# Altium schematic sheet 12_Boost.SchDoc
size A; SheetNumber: 12; SheetTotal: 12
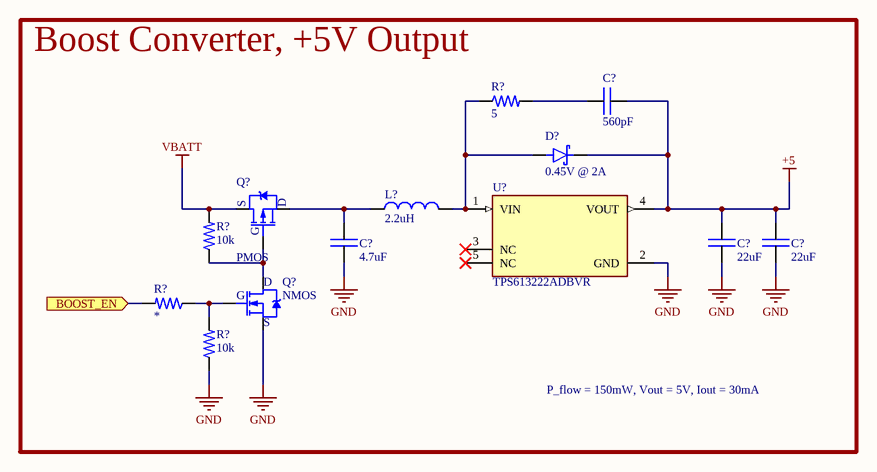
[diagram p0: 12_Boost.SchDoc]

## Parts
(Parts that share a designator on the sheet are numbered #1, #2 ... from top to bottom, then left to right.)
C?#1  value 560pF  [0402C]  (hidden comment: CAP)
C?#2  value 4.7uF  [0402C]  (hidden comment: CAP)
C?#3  value 22uF  [0805C]  (hidden comment: CAP)
C?#4  value 22uF  [0805C]  (hidden comment: CAP)
D?  0.45V @ 2A  [SMAF]
L?  value 2.2uH  [0806L]  (hidden comment: IND)
Q?#1  PMOS  [SOT-23]
Q?#2  NMOS
R?#1  value 5  [0402R]  (hidden comment: RES)
R?#2  value 10k  [0402R]  (hidden comment: RES)
R?#3  RES  [0402R]  (value not drawn)
R?#4  value 10k  [0402R]  (hidden comment: RES)
U?  TPS613222ADBVR  [SOT-23-5]

## Ports
BOOST_EN (in)

## Nets
+5: C?#1.2 C?#3.2 C?#4.2 D?.K U?.4(VOUT)
GND: C?#2.1 C?#3.1 C?#4.1 Q?#2.2(S) R?#4.1 U?.2(GND)
VBATT: Q?#1.2(D) R?#2.2
BOOST_EN: R?#3.2 ; port BOOST_EN
NetC?#1_1: C?#1.1 R?#1.2
NetC?#2_2: C?#2.2 L?.1 Q?#1.3(S)
NetD?_A: D?.A L?.2 R?#1.1 U?.1(VIN)
NetQ?#1_1: Q?#1.1(G) Q?#2.3(D) R?#2.1
NetQ?#2_1: Q?#2.1(G) R?#3.1 R?#4.2

Not connected (* = marked no-connect by the designer): U? 3(NC)* 5(NC)*

## Notes on the sheet
- (near R?#1) Boost Converter, +5V Output
- P_flow = 150mW, Vout = 5V, Iout = 30mA

## Library data of the parts
C?#1 C?#2 = CAP: Capacitor; Footprint: *
  C?#1: MFR: *; MFR PN: *; JLCPCB PN: *
C?#3 C?#4 = CAP: Capacitor; MFR: Samsung Electro-Mechanics; MFR PN: CL21A226MAQNNNE; JLCPCB PN: C45783; Footprint: *
D? = SCHOTTKY DIODE: MFR: Shandong Jingdao Microelectronics; MFR PN: SSL24F; Value: SSL24F; JLCPCB PN: C4749014
L? = IND: INDUCTOR; MFR: Sunlord; MFR PN: WPN201610U2R2MT; JLCPCB PN: C71386; Footprint: *
Q?#1 = PMOS: P-Channel MOSFET; MFR: Diodes Incorporated; Value: BSS84-7-F; Footprint: *; JLCPCB PN: *
Q?#2 = NMOS: N-Channel MOSFET; MFR: Diodes Incorporated; Value: DMN63D8L; Type: SMD; Footprint: *; JLCPCB PN: *
R?#1-R?#4 = RES: Resistor; MFR PN: *; MFR: *; JLCPCB PN: *
  R?#3: Value: *
U? = BOOST 3.3V-5V FIXED: 6-uA Quiescent Current, 1.8-A Switch Current Boost Converter 5-SOT-23 -40 to 85; MFR: Texas Instruments; MFR PN: TPS613222ADBVR; Value: TPS613222ADBVR